# EasyEDA Pro project NUEVO board Rev. B.epro, schematic Schematic2
Board Name: H-Bridge; Create Date: 2025-10-29; Page Name: P1; Project Name: 162 Carrier Board; Schematic Name: Schematic2; Update Date: 2025-11-05; Company: EasyEDA.com; Page Size: A4; Version: V1.0
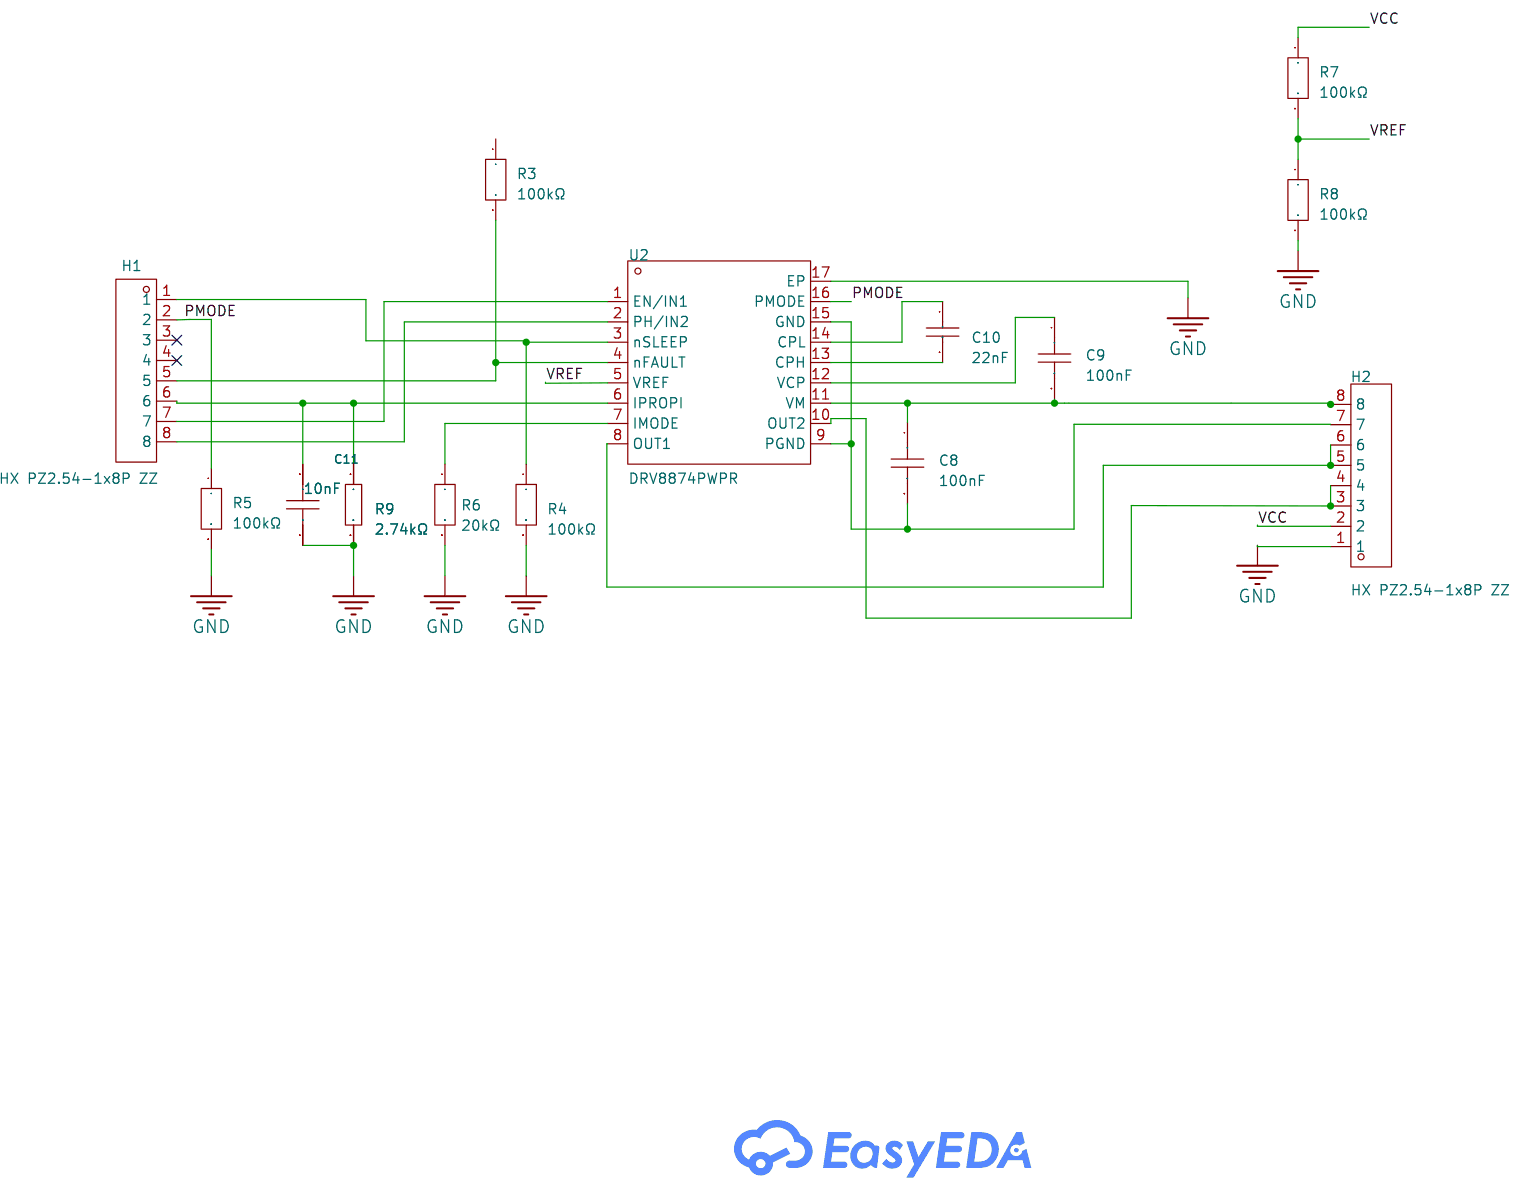
[diagram p4: schematic sheet]

## Parts
C8  100nF  [C0402]
C9  100nF  [C0402]
C10  22nF  [C0402]
C11  10nF  [C0402]
H1  HX PZ2.54-1x8P ZZ  [HDR-TH_8P-P2.54-V-M]
H2  HX PZ2.54-1x8P ZZ  [HDR-TH_8P-P2.54-V-M]
R3  100kΩ  [R0603]
R4  100kΩ  [R0603]
R5  100kΩ  [R0603]
R6  20kΩ  [R0805]
R7  100kΩ  [R0603]
R8  100kΩ  [R0603]
R9  2.74kΩ  [R0603]
U2  DRV8874PWPR  [HTSSOP-16_L5.0-W4.4-P0.65-LS6.4-BL-EP]

## Library data of the parts
C8 C9 = CL05B104KB54PNC: Capacitance:100nF Tolerance:±10% Tolerance:±10% Voltage Rating:50V Temperature Coefficient:X7R; LCSC Part Name: 100nF ±10% 50V; Supplier Part: C307331; Manufacturer: SAMSUNG(三星); Supplier Footprint: 0402; JLCPCB Part Class: Basic Part; Datasheet: https://item.szlcsc.com/datasheet/CL05B104KB54PNC/291005.html; Supplier: LCSC; Tolerance: ±10%; Voltage Rating: 50V; Temperature Coefficient: X7R
C10 = 0402B223K500NT: Capacitance:22nF Tolerance:±10% Tolerance:±10% Voltage Rating:50V Temperature Coefficient:X7R; LCSC Part Name: 22nF ±10% 50V; Supplier Part: C1532; Manufacturer: FH(风华); Supplier Footprint: 0402; JLCPCB Part Class: Basic Part; Datasheet: https://item.szlcsc.com/datasheet/0402B223K500NT/1884.html; Supplier: LCSC; Tolerance: ±10%; Voltage Rating: 50V; Temperature Coefficient: X7R
C11 = AC0402KRX7R9BB103: Capacitance:10nF Tolerance:±10% Tolerance:±10% Voltage Rating:50V Temperature Coefficient:X7R; LCSC Part Name: 10nF ±10% 50V; Supplier Part: C277500; Manufacturer: YAGEO(国巨); Supplier Footprint: 0402; JLCPCB Part Class: Extended Part; Datasheet: https://item.szlcsc.com/datasheet/AC0402KRX7R9BB103/264819.html; Supplier: LCSC; Tolerance: ±10%; Voltage Rating: 50V; Temperature Coefficient: X7R
H1 H2 = HX PZ2.54-1x8P ZZ: Pin Structure:1x8P Pitch:2.54mm Row Spacing:- Circluar Pins/Square Pins:Pin Header Mounting Type:Through Hole Number of Rows:1 Number of Pins:8P Current Rating:3A Voltage Rating (Max):1kV Length of Mating Pin:6mm Insulation Height:2.5mm Length of End Conn; LCSC Part Name: 1x8P 间距:2.54mm 方针 直插; Supplier Part: C32713274; Manufacturer: hanxia(韩下); Supplier Footprint: 插件,P=2.54mm; JLCPCB Part Class: Extended Part; Datasheet: https://item.szlcsc.com/datasheet/HX%2520PZ2.54-1x8P%2520ZZ/34444554.html; Supplier: LCSC; Pin Structure: 1x8P; Pitch: 2.54mm; Circluar Pins/Square Pins: Pin Header; Mounting Type: Through Hole; Number of Rows: 1; Number of Pins: 8P; Current Rating: 3A; Voltage Rating (Max): 1kV; Length of Mating Pin: 6mm; Insulation Height: 2.5mm; Length of End Connection Pin: 3mm; Contact Material: Brass; Contact Plating: Gold; Operating Temperature: -40℃~+105℃; Color: Black
R3-R5 R7 R8 = KTR03EZPF1003: Type:Thick Film Resistor Resistance:100kΩ Tolerance:±1% Tolerance:±1% Power(Watts):100mW Voltage-Supply(Max):350V Temperature Coefficient:±100ppm/℃ Temperature Coefficient:±100ppm/℃ Operating Temperature:-55℃~+155℃ Operating Temperature:-55℃~+155℃; LCSC Part Name: 厚膜电阻 100kΩ ±1% 100mW; Supplier Part: C510119; Manufacturer: ROHM(罗姆); Supplier Footprint: 0603; JLCPCB Part Class: Extended Part; Datasheet: https://item.szlcsc.com/datasheet/KTR03EZPF1003/523936.html; Supplier: LCSC; Type: Thick Film Resistor; Tolerance: ±1%; Power(Watts): 100mW; Voltage-Supply(Max): 350V; Temperature Coefficient: ±100ppm/℃; Operating Temperature: -55℃~+155℃
R6 = FRC0805F2002TS: Type:Thick Film Resistor Resistance:20kΩ Tolerance:±1% Tolerance:±1% Power(Watts):125mW Voltage-Supply(Max):150V Temperature Coefficient:±100ppm/℃ Temperature Coefficient:±100ppm/℃ Operating Temperature:-55℃~+155℃ Operating Temperature:-55℃~+155℃; LCSC Part Name: 20kΩ ±1% 125mW 厚膜电阻; Supplier Part: C2907240; Manufacturer: FOJAN(富捷); Supplier Footprint: 0805; JLCPCB Part Class: Extended Part; Supplier: LCSC; Type: Thick Film Resistor; Tolerance: ±1%; Power(Watts): 125mW; Voltage-Supply(Max): 150V; Temperature Coefficient: ±100ppm/℃; Operating Temperature: -55℃~+155℃
R9 = RC0603FR-072K74L: Type:Thick Film Resistors Resistance: Tolerance:±1% Tolerance:±1% Power(Watts): Overload Voltage (Max): Temperature Coefficient:±100ppm/℃ Temperature Coefficient:±100ppm/℃ Operating Temperature Range:-55℃~+155℃ Operating Temperature Range:-55℃~+155℃; LCSC Part Name: 厚膜电阻 2.74kΩ ±1% 100mW; Supplier Part: C185342; Manufacturer: YAGEO(国巨); Supplier Footprint: 0603; JLCPCB Part Class: Extended Part; Datasheet: https://atta.szlcsc.com/upload/public/pdf/source/20180904/C276339_014E484F1DBA106FB92D45EABD5A1AC1.pdf; Supplier: LCSC; Type: Thick Film Resistors; Tolerance: ±1%; Temperature Coefficient: ±100ppm/℃; Operating Temperature Range: -55℃~+155℃
U2 = DRV8874PWPR: Voltage - Supply:- Voltage - Supply:- Output Current:- Output Current:- RDS(on):200mΩ Peak Current:9A Operating Temperature:-40℃~+125℃ Operating Temperature:-40℃~+125℃; LCSC Part Name: 6A 有刷直流电机驱动芯片 4.5V~37V; Supplier Part: C1855818; Manufacturer: TI(德州仪器); Supplier Footprint: HTSSOP-16-EP; JLCPCB Part Class: Extended Part; Datasheet: https://www.ti.com/cn/lit/gpn/drv8874; Supplier: LCSC; RDS(on): 200mΩ; Peak Current: 9A; Operating Temperature: -40℃~+125℃

## Nets
GND: C11.1 H2.1 R4.2 R5.2 R6.2 R8.2 R9.2 U2.17(EP)
VCC: H2.2 R7.1
PMODE: H1.2 R5.1 U2.16(PMODE)
VREF: R7.2 R8.1 U2.5(VREF)
$1N764: H2.5 H2.6 U2.8(OUT1)
$1N774: H2.3 H2.4 U2.10(OUT2)
$1N1117: C9.1 U2.12(VCP)
$1N1191: C10.2 U2.13(CPH)
$1N1199: C10.1 U2.14(CPL)
$1N1276: H1.5 R3.2 U2.4(nFAULT)
$1N1285: H1.1 R4.1 U2.3(nSLEEP)
$1N1397: H1.7 U2.1(EN/IN1)
$1N1403: H1.8 U2.2(PH/IN2)
$1N1942: R6.1 U2.7(IMODE)
$1N2609: C11.2 H1.6 R9.1 U2.6(IPROPI)
Net-(C8-1): C8.1 H2.8 U2.11(VM)
Net-(C8-2): C8.2 U2.9(PGND) U2.15(GND)

Not connected (* = marked no-connect by the designer): C9 2; H1 3* 4*; H2 7; R3 1
